# EAGLE schematic BBB_TVbNull (EAGLE 5.10)
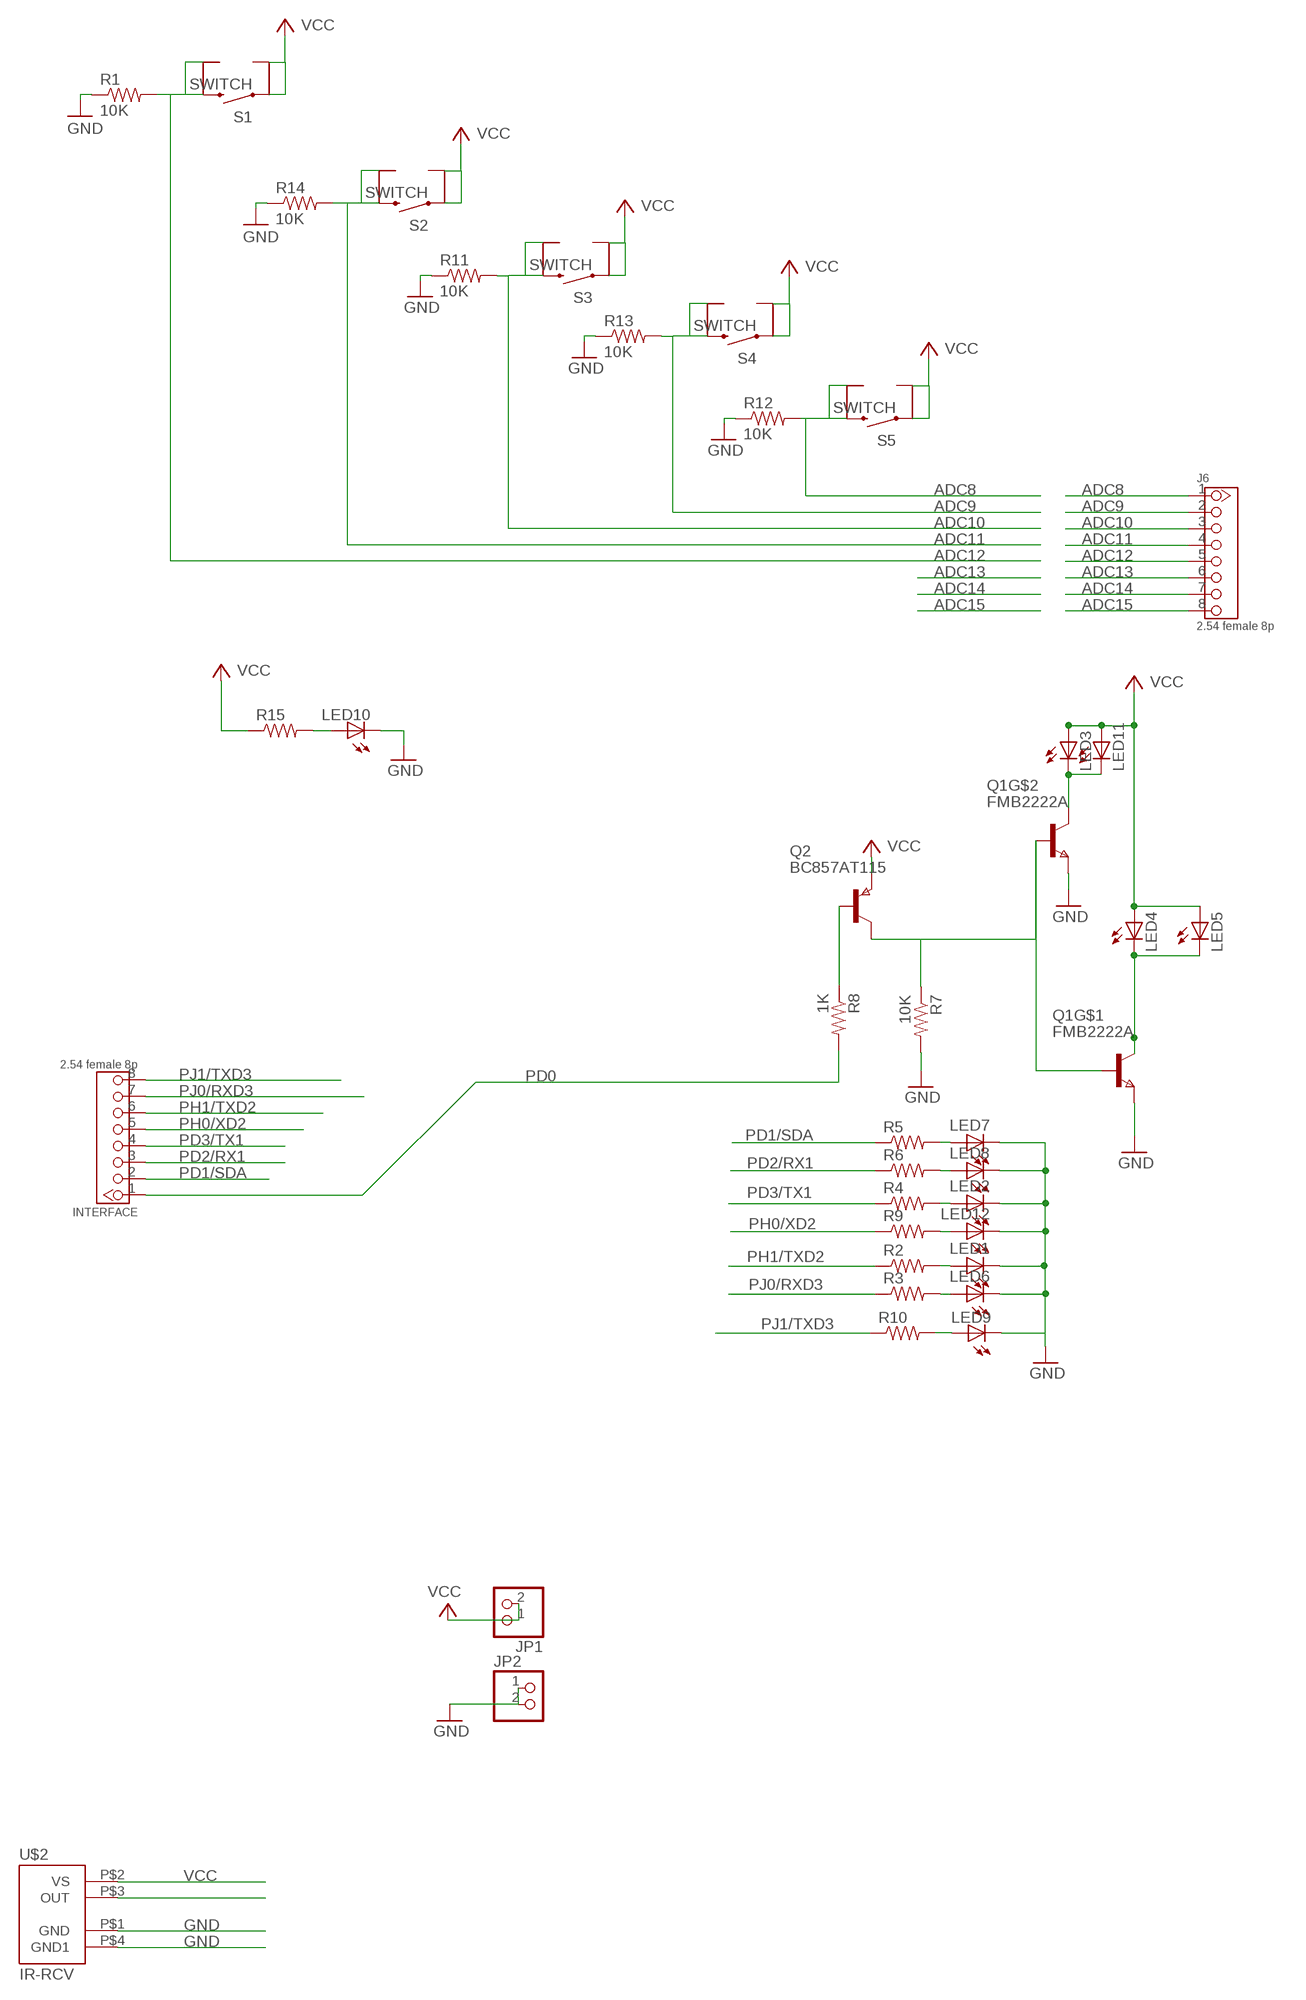
[diagram p0: schematic, sheet 1]

## Parts
INTERFACE  2.54 female 8p  HEADER-8P2.54  [CK_1X8]
J6  2.54 female 8p  HEADER-8P2.54  [CK_1X8]
JP1  PINHD-1X2  [1X02]
JP2  PINHD-1X2  [1X02]
LED1  LEDCHIPLED_1206  [CHIPLED_1206]
LED2  LEDCHIPLED_1206  [CHIPLED_1206]
LED3  LEDSIDEIR  [SIDE_IR_NSL]
LED4  LEDSIDEIR  [SIDE_IR_NSL]
LED5  LED5MM  [LED5MM]
LED6  LEDCHIPLED_1206  [CHIPLED_1206]
LED7  LEDCHIPLED_1206  [CHIPLED_1206]
LED8  LEDCHIPLED_1206  [CHIPLED_1206]
LED9  LEDCHIPLED_1206  [CHIPLED_1206]
LED10  LEDCHIPLED_1206  [CHIPLED_1206]
LED11  LED5MM  [LED5MM]
LED12  LEDCHIPLED_1206  [CHIPLED_1206]
Q1  FMB2222A  DUALNPN  [SSOT6]
Q2  BC857AT115  PNPSOT323SOT416  [SOT416]
R1  10K  RESISTOR  [0805]
R2  1.5K  RESISTOR  [0805]
R3  1.5K  RESISTOR  [0805]
R4  1.5K  RESISTOR  [0805]
R5  1.5K  RESISTOR  [0805]
R6  1.5K  RESISTOR  [0805]
R7  10K  RESISTOR  [0805]
R8  1K  RESISTOR  [0805]
R9  1.5K  RESISTOR  [0805]
R10  1.5K  RESISTOR  [0805]
R11  10K  RESISTOR  [0805]
R12  10K  RESISTOR  [0805]
R13  10K  RESISTOR  [0805]
R14  10K  RESISTOR  [0805]
R15  1.5K  RESISTOR  [0805]
S1  SWITCH  SWITCH-MOMENTARY-2SMD  [TACTILE_SWITCH_SMD]
S2  SWITCH  SWITCH-MOMENTARY-2SMD  [TACTILE_SWITCH_SMD]
S3  SWITCH  SWITCH-MOMENTARY-2SMD  [TACTILE_SWITCH_SMD]
S4  SWITCH  SWITCH-MOMENTARY-2SMD  [TACTILE_SWITCH_SMD]
S5  SWITCH  SWITCH-MOMENTARY-2SMD  [TACTILE_SWITCH_SMD]
U$2  IR-RCV  [IR-RCV]

## Nets
ADC8: J6.1 R12.2 S5.3 S5.4
ADC9: J6.2 R13.2 S4.3 S4.4
ADC10: J6.3 R11.2 S3.3 S3.4
ADC11: J6.4 R14.2 S2.3 S2.4
ADC12: J6.5 R1.2 S1.3 S1.4
ADC13: J6.6
ADC14: J6.7
ADC15: J6.8 U$2.P$3(OUT)
GND: JP2.1 JP2.2 LED1.C LED2.C LED6.C LED7.C LED8.C LED9.C LED12.C Q1.2(E) Q1.5(E) R1.1 R7.2 R11.1 R12.1 R13.1 R14.1 U$2.P$1(GND) U$2.P$4(GND1)
N$3: LED1.A R2.2
N$4: LED6.A R3.2
N$5: Q1.1(B) Q1.3(B) Q2.1(C) R7.1
N$6: Q2.2(B) R8.1
N$7: LED3.C LED11.K(C) Q1.4(C)
N$8: LED4.C LED5.K(C) Q1.6(C)
N$9: LED9.A R10.2
N$10: LED7.A R5.2
N$11: LED8.A R6.2
N$13: LED2.A R4.2
N$14: LED12.A R9.2
N$15: LED10.A R15.2
N$16: LED10.C
PD0: INTERFACE.1 R8.2
PD1/SDA: INTERFACE.2 R5.1
PD2/RX1: INTERFACE.3 R6.1
PD3/TX1: INTERFACE.4 R4.1
PH0/XD2: INTERFACE.5 R9.1
PH1/TXD2: INTERFACE.6 R2.1
PJ0/RXD3: INTERFACE.7 R3.1
PJ1/TXD3: INTERFACE.8 R10.1
VCC: JP1.1 JP1.2 LED3.A LED4.A LED5.A LED11.A Q2.3(E) R15.1 S1.1 S1.2 S2.1 S2.2 S3.1 S3.2 S4.1 S4.2 S5.1 S5.2 U$2.P$2(VS)

## Library data of the parts
INTERFACE J6 = Connector:HEADER-8P
JP1 JP2 = pinhead:PINHD-1X2: PIN HEADER
LED1 LED2 LED6-LED10 LED12 = minimidi:LED: LED
LED3 LED4 = tvbgone3:LED: LED
LED5 LED11 = led:LED: LED
Q1 = fairchild-semic:DUALNPN
Q2 = zetex:PNPSOT323: PNP TRANSISTOR
R1-R15 = SparkFun:RESISTOR: Resistor Basic schematic elements and footprints for 0603, 1206, and PTH 1/10th watt (small) resistors.
S1-S5 = SparkFun:SWITCH-MOMENTARY-2
U$2 = IR-rcv:IR-RCV